# Altium schematic sheet [13] - HEADERS, SPI.SchDoc
size A2; DocumentNumber: 13; SheetNumber: 13; SheetTotal: 18
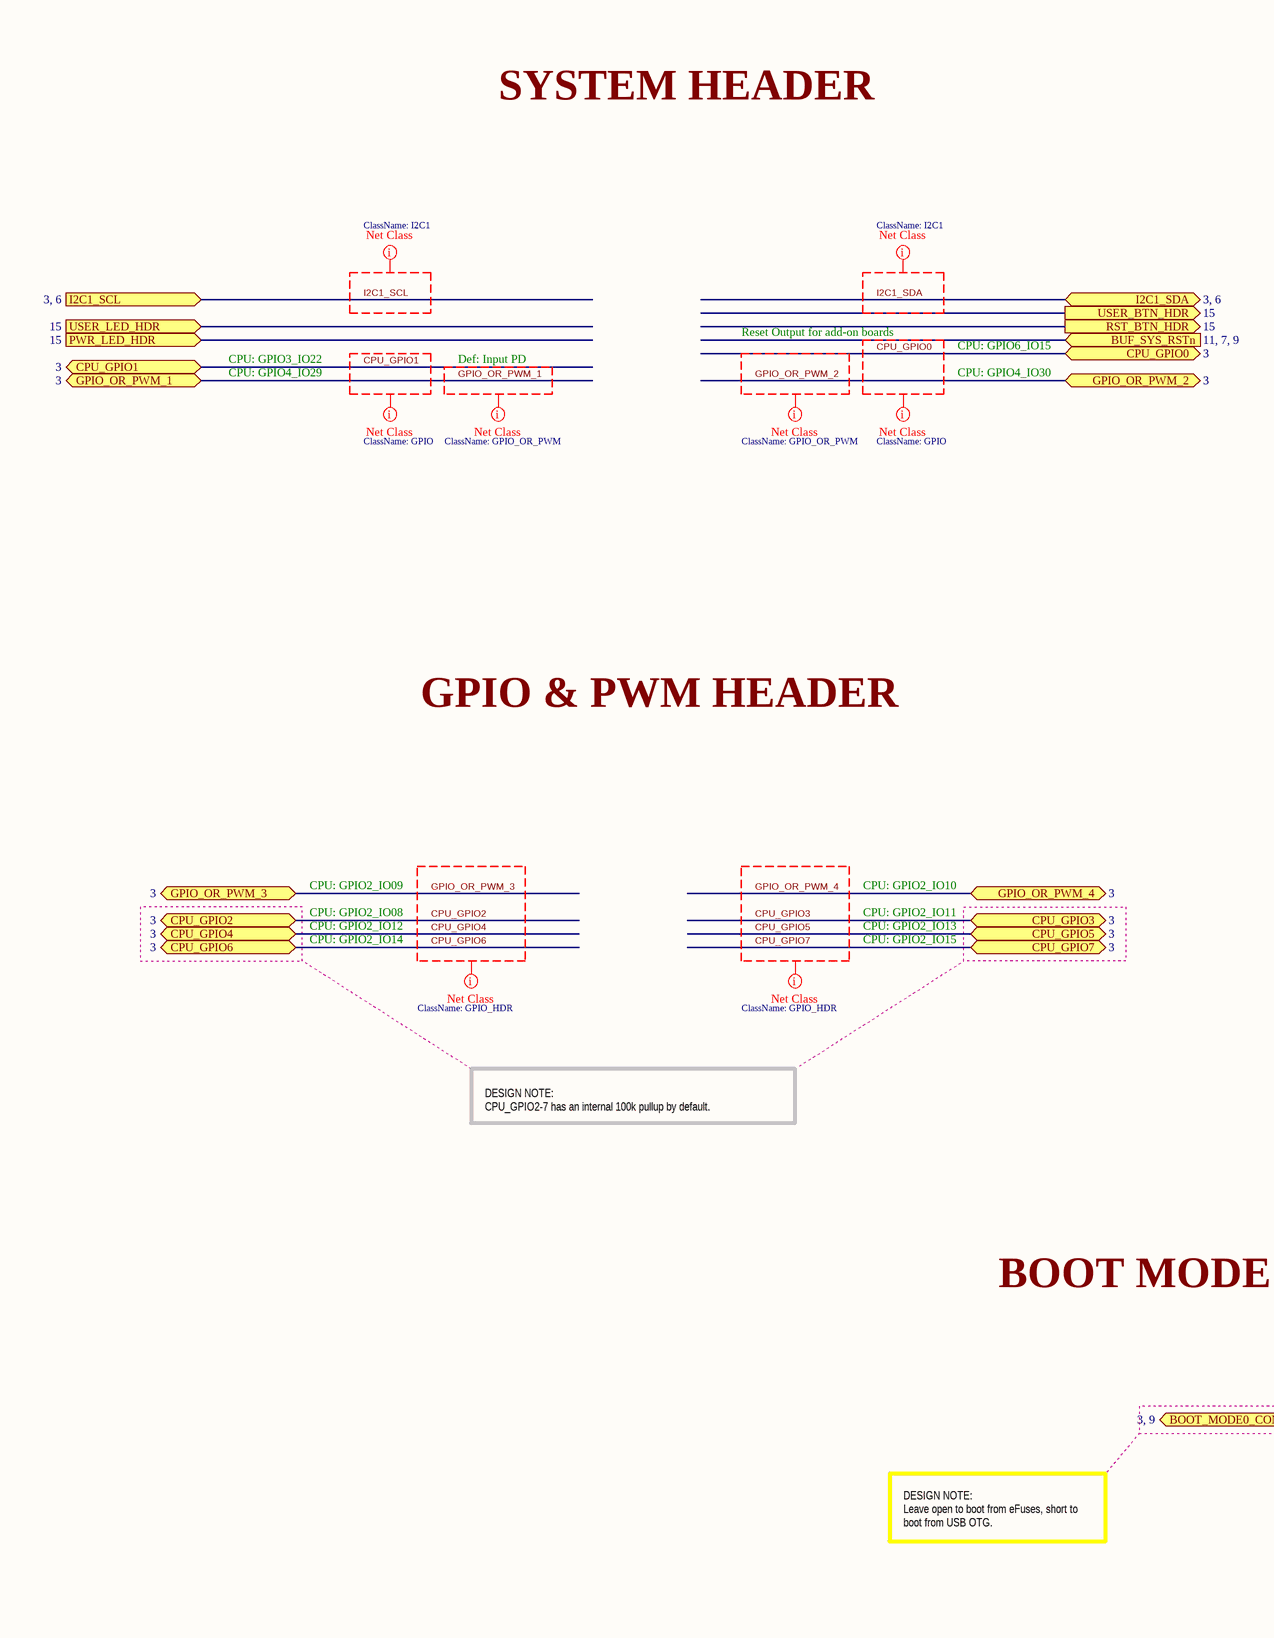
[diagram p0: [13] - HEADERS, SPI.SchDoc, left]
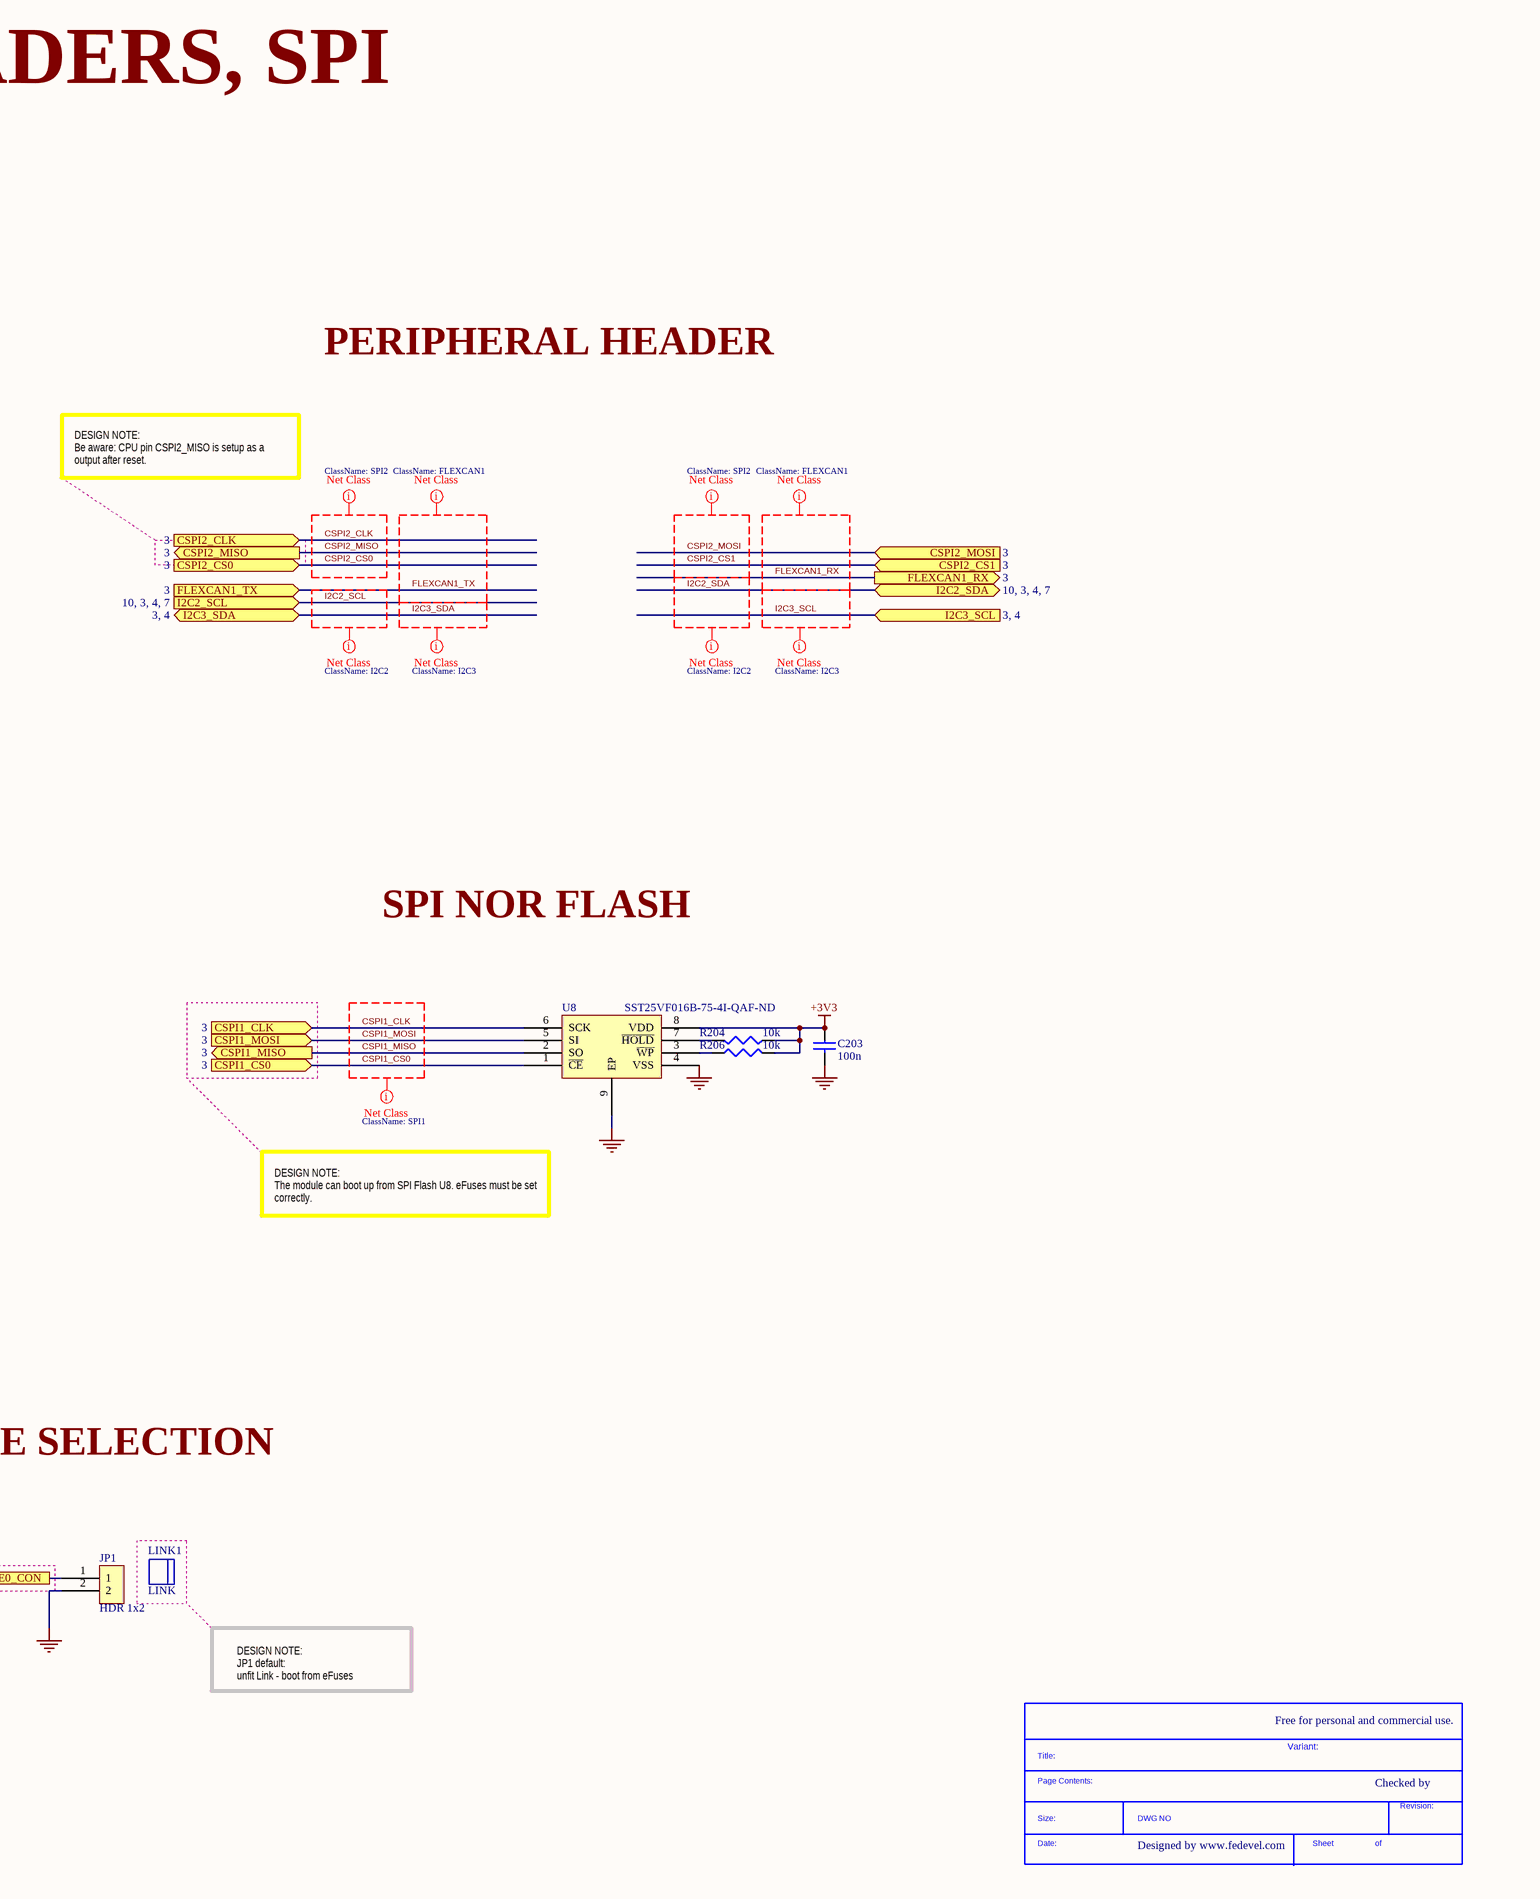
[diagram p1: [13] - HEADERS, SPI.SchDoc, right]

## Parts
*  SDTitleBlock  (value not drawn)  (graphical)
C203  100n  [C0402]
JP1  HDR 1x2  [HDR_1x2_2.54MM]
LINK1  LINK  (mechanical)
R204  10k  [R0402]
R206  10k  [R0402]
U8  SST25VF016B-75-4I-QAF-ND  [WSON8_6X5MM]

## Ports
BOOT_MODE0_CON (see 3, 9), BUF_SYS_RSTn (see 11, 7, 9), CPU_GPIO0 (bidir, see 3), CPU_GPIO1 (bidir, see 3), CPU_GPIO2 (bidir, see 3), CPU_GPIO3 (bidir, see 3), CPU_GPIO4 (bidir, see 3), CPU_GPIO5 (bidir, see 3), CPU_GPIO6 (bidir, see 3), CPU_GPIO7 (bidir, see 3), CSPI1_CLK (in, see 3), CSPI1_CS0 (in, see 3), CSPI1_MISO (out, see 3), CSPI1_MOSI (in, see 3), CSPI2_CLK (in, see 3), CSPI2_CS0 (in, see 3), CSPI2_CS1 (in, see 3), CSPI2_MISO (out, see 3), CSPI2_MOSI (in, see 3), FLEXCAN1_RX (out, see 3), FLEXCAN1_TX (in, see 3), GPIO_OR_PWM_1 (bidir, see 3), GPIO_OR_PWM_2 (bidir, see 3), GPIO_OR_PWM_3 (bidir, see 3), GPIO_OR_PWM_4 (bidir, see 3), I2C1_SCL (see 3, 6), I2C1_SDA (bidir, see 3, 6), I2C2_SCL (see 10, 3, 4, 7), I2C2_SDA (bidir, see 10, 3, 4, 7), I2C3_SCL (see 3, 4), I2C3_SDA (bidir, see 3, 4), PWR_LED_HDR (in, see 15), RST_BTN_HDR (out, see 15), USER_BTN_HDR (out, see 15), USER_LED_HDR (in, see 15)

## Nets
+3V3: C203.1 R204.1 R206.2 U8.8(VDD)
GND: C203.2 JP1.2 U8.4(VSS) U8.9(EP)
BOOT_MODE0_CON: JP1.1 ; port BOOT_MODE0_CON
CPU_GPIO0: port CPU_GPIO0
CPU_GPIO1: port CPU_GPIO1
CPU_GPIO2: port CPU_GPIO2
CPU_GPIO3: port CPU_GPIO3
CPU_GPIO4: port CPU_GPIO4
CPU_GPIO5: port CPU_GPIO5
CPU_GPIO6: port CPU_GPIO6
CPU_GPIO7: port CPU_GPIO7
CSPI1_CLK: U8.6(SCK) ; port CSPI1_CLK
CSPI1_CS0: U8.1(~{CE}) ; port CSPI1_CS0
CSPI1_MISO: U8.2(SO) ; port CSPI1_MISO
CSPI1_MOSI: U8.5(SI) ; port CSPI1_MOSI
CSPI2_CLK: port CSPI2_CLK
CSPI2_CS0: port CSPI2_CS0
CSPI2_CS1: port CSPI2_CS1
CSPI2_MISO: port CSPI2_MISO
CSPI2_MOSI: port CSPI2_MOSI
FLEXCAN1_RX: port FLEXCAN1_RX
FLEXCAN1_TX: port FLEXCAN1_TX
GPIO_OR_PWM_1: port GPIO_OR_PWM_1
GPIO_OR_PWM_2: port GPIO_OR_PWM_2
GPIO_OR_PWM_3: port GPIO_OR_PWM_3
GPIO_OR_PWM_4: port GPIO_OR_PWM_4
I2C1_SCL: port I2C1_SCL
I2C1_SDA: port I2C1_SDA
I2C2_SCL: port I2C2_SCL
I2C2_SDA: port I2C2_SDA
I2C3_SCL: port I2C3_SCL
I2C3_SDA: port I2C3_SDA
NetR204_2: R204.2 U8.7(~{HOLD})
NetR206_1: R206.1 U8.3(~{WP})

## Layout directives
net class SPI1: CSPI1_CLK, CSPI1_CS0, CSPI1_MISO, CSPI1_MOSI
net class GPIO: CPU_GPIO0, CPU_GPIO1
net class GPIO_OR_PWM: GPIO_OR_PWM_1, GPIO_OR_PWM_2
net class I2C3: I2C3_SCL, I2C3_SDA
net class I2C2: I2C2_SCL, I2C2_SDA
net class SPI2: CSPI2_CLK, CSPI2_CS0, CSPI2_CS1, CSPI2_MISO, CSPI2_MOSI
net class GPIO_HDR: CPU_GPIO2, CPU_GPIO3, CPU_GPIO4, CPU_GPIO5, CPU_GPIO6, CPU_GPIO7, GPIO_OR_PWM_3, GPIO_OR_PWM_4
net class I2C1: I2C1_SCL, I2C1_SDA
net class FLEXCAN1: FLEXCAN1_RX, FLEXCAN1_TX

## Notes on the sheet
- HEADERS, SPI
- SYSTEM HEADER
- PERIPHERAL HEADER
- DESIGN NOTE:
  Be aware: CPU pin CSPI2_MISO is setup as a output after reset.
- CPU: GPIO4_IO29
- CPU: GPIO3_IO22
- Def: Input PD
- Reset Output for add-on boards
- CPU: GPIO6_IO15
- CPU: GPIO4_IO30
- GPIO & PWM HEADER
- SPI NOR FLASH
- CPU: GPIO2_IO09
- CPU: GPIO2_IO08
- CPU: GPIO2_IO10
- CPU: GPIO2_IO11
- CPU: GPIO2_IO12
- CPU: GPIO2_IO14
- CPU: GPIO2_IO13
- CPU: GPIO2_IO15
- DESIGN NOTE:
  The module can boot up from SPI Flash U8. eFuses must be set correctly.
- DESIGN NOTE:
  CPU_GPIO2-7 has an internal 100k pullup by default.
- BOOT MODE SELECTION
- DESIGN NOTE:
  Leave open to boot from eFuses, short to boot from USB OTG.
- DESIGN NOTE:
  JP1 default:
  unfit Link - boot from eFuses
- Free for personal and commercial use.
- Variant:
- Checked by
- Designed by www.fedevel.com
- (in symbol SDTitleBlock) Title:; Page Contents:; Revision:; Size:; DWG NO; Date:; Sheet; of

## Library data of the parts
C203 = C1005X5R1H104K: CAP CER .10UF 50V X5R 10% 0402; Manufacturer: TDK Corporation; Capacitance: 0.1µF; Value: 100nF; .Checked PCB: used; Category: Capacitors; Manufacturer Part Number: C1005X5R1H104K; Operating Temperature: -55°C ~ 85°C; Package / Case: 0402 (1005 Metric); Price 1k [$]: 0.02340; .Checked SCH: used; Voltage - Rated: 50V; Supplier Part Number: 445-5942-1-ND; Supplier: Digikey; Supplier 1: Digi-Key; Supplier Part Number 1: 445-5942-1-ND; RoHS: RoHS Compliant; Stock 1: 106926; Pricing 1: 1=0.27, 10=0.18, 100=0.072, 250=0.05176, 500=0.0369, 1000=0.027 (USD); Tolerance: ±10%; Temperature Coefficient: X5R; Mounting Type: Surface Mount, MLCC; Applications: General Purpose; Ratings: -; Size / Dimension: 0.039" L x 0.020" W (1.00mm x 0.50mm); Height - Seated (Max): -; Thickness (Max): 0.022" (0.55mm); Lead Spacing: -; Features: -; Packaging: Cut Tape (CT); Lead Style: -; ComponentLink1URL: http://www.tdk.co.jp/tefe02/e412_c.pdf; ComponentLink1Description: http://www.tdk.co.jp/tefe02/e412_c.pdf
JP1 = 68001-202HLF: BERGSTIK II .100" SR STRAIGHT; Manufacturer: FCI; Connector Type: Header, Unshrouded; Number of Positions: 2; Number of Positions Loaded: All; Pitch: 0.100" (2.54mm); .Checked PCB: used; Supplier 1: Digi-Key; Supplier Part Number 1: 609-3469-ND; Manufacturer Part Number: 68001-202HLF; RoHS: RoHS Compliant; Category: Connectors, Interconnects; Stock 1: 13680; Pricing 1: 1=0.45, 10=0.265, 100=0.1172, 250=0.09828, 500=0.09072, 1000=0.07938, 5000=0.05065 (USD); Contact Type: Male Pin; Number of Rows: 1; Row Spacing: -; Contact Mating Length: 0.230" (5.84mm); Mounting Type: Through Hole; Termination: Solder; Fastening Type: -; Features: -; Contact Finish: Gold; Contact Finish Thickness: 15µin (0.38µm); Color: Black; Packaging: Bulk; ComponentLink1URL: http://portal.fciconnect.com/res/en/pdffiles/doc_search/68000.pdf; ComponentLink1Description: http://portal.fciconnect.com/res/en/pdffiles/doc_search/68000.pdf; .Checked SCH: used
LINK1 = QPC02SXGN-RC: CONN JUMPER SHORTING .100" GOLD; Manufacturer: Sullins Connector Solutions; Gender: Female Sockets; Number of Positions or Pins (Grid): 2 (1 x 2); Pitch: 0.100" (2.54mm); .Checked SCH: used; Supplier 1: Digi-Key; Supplier Part Number 1: S9337-ND; Manufacturer Part Number: QPC02SXGN-RC; RoHS: RoHS Compliant; Category: Connectors, Interconnects; Stock 1: 23274; Pricing 1: 1=0.11, 10=0.066, 25=0.0468, 50=0.0384, 100=0.033, 250=0.02792, 500=0.0258, 1000=0.0228, 2500=0.018 (USD); Type: Open Top; Height: 0.235" (5.97mm); Contact Finish: Gold; Contact Finish Thickness: Flash; Color: -; Packaging: Bulk; ComponentLink1URL: http://www.sullinscorp.com/drawings/284_SXGN_11510.pdf; ComponentLink1Description: http://www.sullinscorp.com/drawings/284_SXGN_11510.pdf
R204 R206 = RC0402FR-0710KL: RES 10.0K OHM 1/16W 1% 0402 SMD; Manufacturer: Yageo; Power (Watts): 0.063W, 1/16W; .Checked PCB: used; Temperature Coefficient: ±100ppm/°C; Category: Resistors; Manufacturer Part Number: RC0402FR-0710KL; Package / Case: 0402 (1005 Metric); Price 1k [$]: 0.01421; Resistance (Ohms): 10K; Tolerance: ±1%; Value: 10k; .Checked SCH: used; Supplier Part Number: 311-10.0KLRCT-ND; Supplier: Digikey; Supplier 1: Digi-Key; Supplier Part Number 1: 311-10.0KLRCT-ND; RoHS: RoHS Compliant; Stock 1: 2916495; Pricing 1: 10=0.014, 50=0.0104, 100=0.0079, 250=0.00584, 500=0.00432, 1000=0.00288 (USD); Composition: Thick Film; Features: -; Size / Dimension: 0.039" L x 0.020" W (1.00mm x 0.50mm); Height: 0.016" (0.40mm); Number of Terminations: 2; Packaging: Cut Tape (CT); ComponentLink1URL: http://www.yageo.com/documents/recent/PYu-RC0402_51_RoHS_L_6.pdf; ComponentLink1Description: http://www.yageo.com/documents/recent/PYu-RC0402_51_RoHS_L_6.pdf
U8 = SST25VF016B-75-4I-QAF: IC FLASH 16MBIT 75MHZ 8WSON; Manufacturer: Microchip Technology; Memory Size: 16M (2M x 8); Interface: SPI Serial; Voltage - Supply: 2.7 V ~ 3.6 V; .Creator: MM; .Checked PCB: used; Supplier 1: Digi-Key; Manufacturer Part Number: SST25VF016B-75-4I-QAF; RoHS: RoHS Compliant; Category: Integrated Circuits (ICs); Stock 1: 433; Pricing 1: 1=1.58, 10=1.512, 25=1.4492, 100=1.16, 500=0.97, 1000=0.925 (USD); Packaging: Tube; Format - Memory: FLASH; Memory Type: FLASH; Speed: 75MHz; Operating Temperature: -40°C ~ 85°C; Package / Case: 8-WSON; Supplier Device Package: 8-WSON; ComponentLink1URL: http://ww1.microchip.com/downloads/en/DeviceDoc/25044A.pdf; ComponentLink1Description: http://ww1.microchip.com/downloads/en/DeviceDoc/25044A.pdf; Supplier Part Number 1: SST25VF016B-75-4I-QAF-ND; .Checked SCH: used